# Altium schematic sheet SingleChipBlockDiagram.SchDoc: =ProjectTitle
size A3; PageSetup: Record=PageOptions|CenterHorizontal=True|CenterVertical=True|PrintScale=1.00|XCorrection=1.00|YCorrection=1.00|PrintKind=0|BorderSize=5000000|LeftOffset=0|BottomOffset=0|Orientation=2|PaperLength=1000|PaperWidth=1000|Scale=100|PaperSource=15|PrintQuality=600|MediaType=1|DitherType=10|PaperKind=Letter|PrintScaleMode=1; Author: Jaime I. Chait; Organization: NWES LLC; Address1: 111 SW 5th Ave, STE 3150; Address2: Portland, OR 97204; SheetNumber: 1; SheetTotal: 19
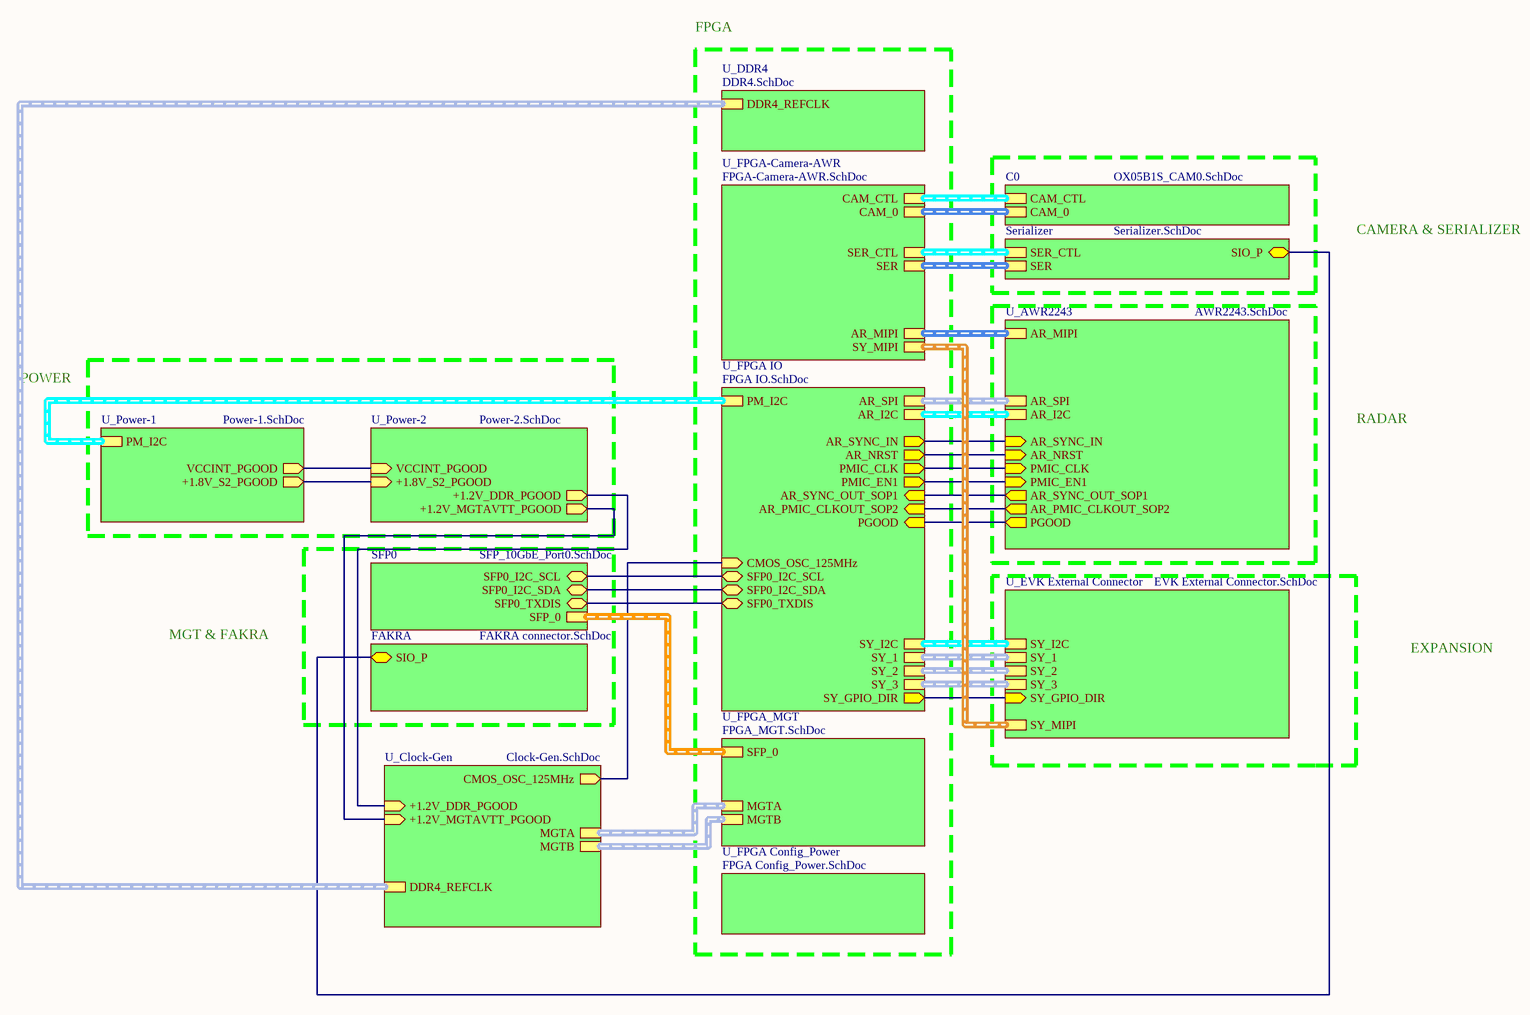
[diagram p0: SingleChipBlockDiagram.SchDoc]

## Sub-sheets
C0 = OX05B1S_CAM0.SchDoc: CAM_0 (harness MIPI), CAM_CTL (harness CAM_CTL)
FAKRA = FAKRA connector.SchDoc: SIO_P (bidir)
Serializer = Serializer.SchDoc: SER (harness MIPI), SER_CTL (harness SER_CTRL), SIO_P (bidir)
SFP0 = SFP_10GbE_Port0.SchDoc: SFP_0 (harness SFT_MGT), SFP0_I2C_SCL (bidir), SFP0_I2C_SDA (bidir), SFP0_TXDIS (bidir)
U_AWR2243 = AWR2243.SchDoc: PMIC_CLK (in), PMIC_EN1 (in), AR_SYNC_OUT_SOP1 (out), AR_PMIC_CLKOUT_SOP2 (out), AR_SPI (harness SPI), AR_MIPI (harness AR_MIPI), PGOOD (out), AR_SYNC_IN (in), AR_NRST (in), AR_I2C (harness I2C)
U_Clock-Gen = Clock-Gen.SchDoc: CMOS_OSC_125MHz (out), +1.2V_MGTAVTT_PGOOD (in), MGTA (harness DIFF_CLK), MGTB (harness DIFF_CLK), DDR4_REFCLK (harness DIFF_CLK), +1.2V_DDR_PGOOD (in)
U_DDR4 = DDR4.SchDoc: DDR4_REFCLK (harness DIFF_CLK)
U_EVK External Connector = EVK External Connector.SchDoc: SY_MIPI (harness SY_MIPI), SY_I2C (harness I2C), SY_1 (harness GPIO group), SY_2 (harness GPIO group), SY_3 (harness GPIO group), SY_GPIO_DIR (in)
U_FPGA Config_Power = FPGA Config_Power.SchDoc: no entries
U_FPGA IO = FPGA IO.SchDoc: CMOS_OSC_125MHz (in), AR_NRST (out), PGOOD (in), PMIC_CLK (out), PMIC_EN1 (out), AR_SYNC_IN (out), AR_SPI (harness SPI), SY_I2C (harness I2C), AR_I2C (harness I2C), AR_PMIC_CLKOUT_SOP2 (in), AR_SYNC_OUT_SOP1 (in), PM_I2C (harness I2C), SFP0_I2C_SCL (bidir), SFP0_I2C_SDA (bidir), SFP0_TXDIS (bidir), SY_1 (harness GPIO group), SY_2 (harness GPIO group), SY_3 (harness GPIO group), SY_GPIO_DIR (out)
U_FPGA-Camera-AWR = FPGA-Camera-AWR.SchDoc: AR_MIPI (harness AR_MIPI), CAM_0 (harness MIPI), CAM_CTL (harness CAM_CTL), SY_MIPI (harness SY_MIPI), SER (harness MIPI), SER_CTL (harness SER_CTRL)
U_FPGA_MGT = FPGA_MGT.SchDoc: MGTA (harness DIFF_CLK), MGTB (harness DIFF_CLK), SFP_0 (harness SFT_MGT)
U_Power-1 = Power-1.SchDoc: +1.8V_S2_PGOOD (out), VCCINT_PGOOD (out), PM_I2C (harness I2C)
U_Power-2 = Power-2.SchDoc: VCCINT_PGOOD (in), +1.2V_MGTAVTT_PGOOD (out), +1.8V_S2_PGOOD (in), +1.2V_DDR_PGOOD (out)

## Nets
(unnamed): sheet U_AWR2243/PMIC_CLK, sheet U_FPGA IO/PMIC_CLK
(unnamed): sheet U_AWR2243/PMIC_EN1, sheet U_FPGA IO/PMIC_EN1
(unnamed): sheet U_AWR2243/AR_SYNC_OUT_SOP1, sheet U_FPGA IO/AR_SYNC_OUT_SOP1
(unnamed): sheet U_AWR2243/AR_PMIC_CLKOUT_SOP2, sheet U_FPGA IO/AR_PMIC_CLKOUT_SOP2
(unnamed): sheet U_AWR2243/PGOOD, sheet U_FPGA IO/PGOOD
(unnamed): sheet U_AWR2243/AR_SYNC_IN, sheet U_FPGA IO/AR_SYNC_IN
(unnamed): sheet U_AWR2243/AR_NRST, sheet U_FPGA IO/AR_NRST
(unnamed): sheet U_FPGA IO/CMOS_OSC_125MHz, sheet U_Clock-Gen/CMOS_OSC_125MHz
(unnamed): sheet U_FPGA IO/SFP0_I2C_SCL, sheet SFP0/SFP0_I2C_SCL
(unnamed): sheet U_FPGA IO/SFP0_I2C_SDA, sheet SFP0/SFP0_I2C_SDA
(unnamed): sheet U_FPGA IO/SFP0_TXDIS, sheet SFP0/SFP0_TXDIS
(unnamed): sheet U_FPGA IO/SY_GPIO_DIR, sheet U_EVK External Connector/SY_GPIO_DIR
(unnamed): sheet U_Power-1/+1.8V_S2_PGOOD, sheet U_Power-2/+1.8V_S2_PGOOD
(unnamed): sheet U_Power-1/VCCINT_PGOOD, sheet U_Power-2/VCCINT_PGOOD
(unnamed): sheet U_Power-2/+1.2V_MGTAVTT_PGOOD, sheet U_Clock-Gen/+1.2V_MGTAVTT_PGOOD
(unnamed): sheet U_Power-2/+1.2V_DDR_PGOOD, sheet U_Clock-Gen/+1.2V_DDR_PGOOD
(unnamed): sheet Serializer/SIO_P, sheet FAKRA/SIO_P

## Buses and harness runs
harness sheet C0/CAM_0 = sheet U_FPGA-Camera-AWR/CAM_0
harness sheet C0/CAM_CTL = sheet U_FPGA-Camera-AWR/CAM_CTL
harness sheet Serializer/SER = sheet U_FPGA-Camera-AWR/SER
harness sheet Serializer/SER_CTL = sheet U_FPGA-Camera-AWR/SER_CTL
harness sheet SFP0/SFP_0 = sheet U_FPGA_MGT/SFP_0
harness sheet U_AWR2243/AR_I2C = sheet U_FPGA IO/AR_I2C
harness sheet U_AWR2243/AR_MIPI = sheet U_FPGA-Camera-AWR/AR_MIPI
harness sheet U_AWR2243/AR_SPI = sheet U_FPGA IO/AR_SPI
harness sheet U_Clock-Gen/DDR4_REFCLK = sheet U_DDR4/DDR4_REFCLK
harness sheet U_Clock-Gen/MGTA = sheet U_FPGA_MGT/MGTA
harness sheet U_Clock-Gen/MGTB = sheet U_FPGA_MGT/MGTB
harness sheet U_EVK External Connector/SY_1 = sheet U_FPGA IO/SY_1
harness sheet U_EVK External Connector/SY_2 = sheet U_FPGA IO/SY_2
harness sheet U_EVK External Connector/SY_3 = sheet U_FPGA IO/SY_3
harness sheet U_EVK External Connector/SY_I2C = sheet U_FPGA IO/SY_I2C
harness sheet U_EVK External Connector/SY_MIPI = sheet U_FPGA-Camera-AWR/SY_MIPI
harness sheet U_FPGA IO/PM_I2C = sheet U_Power-1/PM_I2C

## Notes on the sheet
- FPGA
- CAMERA & SERIALIZER
- POWER
- RADAR
- MGT & FAKRA
- EXPANSION
- Title
- Size:
- Date:
- A4
- Number:
- Time:
- Revision:
- Sheet
- of
- File: